# Altium schematic sheet Sensors_aux.SchDoc
size A3
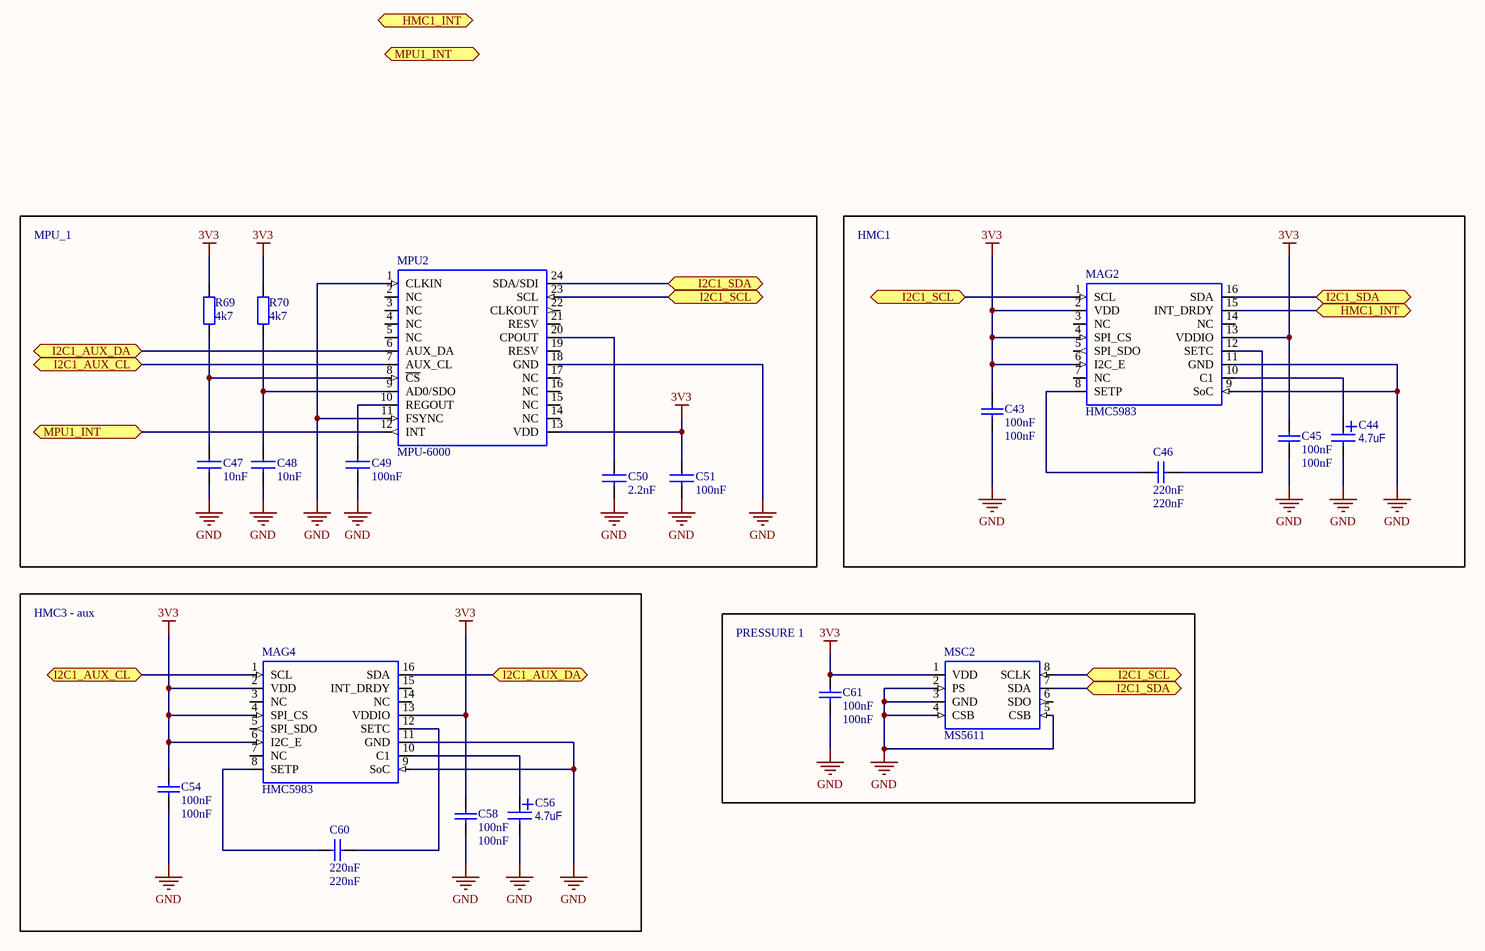
[diagram p0: Sensors_aux.SchDoc]

## Parts
C43  100nF  [080503]
C44  4.7uF  [120605]
C45  100nF  [080503]
C46  220nF  [080503]
C47  10nF  [080503]
C48  10nF  [080503]
C49  100nF  [080503]
C50  2.2nF  [080503]
C51  100nF  [080503]
C54  100nF  [080503]
C56  4.7uF  [120605]
C58  100nF  [080503]
C60  220nF  [080503]
C61  100nF  [080503]
MAG2  HMC5983  [QFN16]
MAG4  HMC5983  [QFN16]
MPU2  MPU-6000  [QFN24]
MSC2  MS5611  [MS5611]
R69  4k7  [080503]
R70  4k7  [080503]

## Blocks framed on the sheet
MPU_1: C47-C51 MPU2 R69 R70
HMC3 - aux: C54 C56 C58 C60 MAG4
PRESSURE 1: C61 MSC2

## Ports
HMC1_INT, I2C1_AUX_CL, I2C1_AUX_DA, I2C1_SCL, I2C1_SDA, MPU1_INT

## Nets
3V3: C43.1 C45.1 C51.1 C54.1 C58.1 C61.2 MAG2.2(VDD) MAG2.4(SPI_CS) MAG2.6(I2C_E) MAG2.13(VDDIO) MAG4.2(VDD) MAG4.4(SPI_CS) MAG4.6(I2C_E) MAG4.13(VDDIO) MPU2.13(VDD) MSC2.1(VDD) R69.2 R70.2
GND: C43.2 C44.2 C45.2 C47.2 C48.2 C49.2 C50.2 C51.2 C54.2 C56.2 C58.2 C61.1 MAG2.9(SoC) MAG2.11(GND) MAG4.9(SoC) MAG4.11(GND) MPU2.1(CLKIN) MPU2.11(FSYNC) MPU2.18(GND) MSC2.2(PS) MSC2.3(GND) MSC2.4(CSB) MSC2.5(CSB)
HMC1_INT: MAG2.15(INT_DRDY) ; port HMC1_INT
I2C1_AUX_CL: MAG4.1(SCL) MPU2.7(AUX_CL) ; port I2C1_AUX_CL
I2C1_AUX_DA: MAG4.16(SDA) MPU2.6(AUX_DA) ; port I2C1_AUX_DA
I2C1_SCL: MAG2.1(SCL) MPU2.23(SCL) MSC2.8(SCLK) ; port I2C1_SCL
I2C1_SDA: MAG2.16(SDA) MPU2.24(SDA/SDI) MSC2.7(SDA) ; port I2C1_SDA
MPU1_INT: MPU2.12(INT) ; port MPU1_INT
NetC44_1: C44.1 MAG2.10(C1)
NetC46_1: C46.1 MAG2.12(SETC)
NetC46_2: C46.2 MAG2.8(SETP)
NetC47_1: C47.1 MPU2.8(~{CS}) R69.1
NetC48_1: C48.1 MPU2.9(AD0/SDO) R70.1
NetC49_1: C49.1 MPU2.10(REGOUT)
NetC50_1: C50.1 MPU2.20(CPOUT)
NetC56_1: C56.1 MAG4.10(C1)
NetC60_1: C60.1 MAG4.12(SETC)
NetC60_2: C60.2 MAG4.8(SETP)

Not connected (* = marked no-connect by the designer): MAG2 3(NC) 5(SPI_SDO) 7(NC) 14(NC); MAG4 3(NC) 5(SPI_SDO) 7(NC) 14(NC) 15(INT_DRDY); MPU2 2(NC) 3(NC) 4(NC) 5(NC) 14(NC) 15(NC) 16(NC) 17(NC) 19(RESV) 21(RESV) 22(CLKOUT); MSC2 6(SDO)

## Notes on the sheet
- HMC1

## Library data of the parts
C43 C45 C54 C58 C61 = CAP: CAP CER 0.1UF 25V 10% X7R 0805; Value: 100nF; Supplier 1: Digi-Key; Supplier Part Number 1: 1276-1099-1-ND
C44 C56 = CAPA_T: CAP TANT 4.7uF 10V 10% 1206; Value: 4.7uF; Supplier 1: Digi-Key; Supplier Part Number 1: 399-3696-1-ND
C46 C60 = CAP: CAP CER 0.22uF 50V X7R 10% 0805; Value: 220nF; Supplier 1: Digi-Key; Supplier Part Number 1: 399-3491-1-ND
C47 C48 = CAPA: CAP CER 10nF 50V 10% X7R 0805; Value: 10nF; Supplier 1: Digi-Key; Supplier Part Number 1: 399-1158-1-ND
C49 C51 = CAPA: CAP CER 0.1UF 25V 10% X7R 0805; Value: 100nF; Supplier 1: Digi-Key; Supplier Part Number 1: 1276-1099-1-ND
C50 = CAPA: CAP CER 2.2nF 50V; Value: 2.2nF; Supplier 1: Digi-Key; Supplier Part Number 1: 399-11167-2-ND
MAG2 MAG4 = HMC5983: HMC5983 MAGNETOMETER; Supplier 1: Digi-Key; Supplier Part Number 1: 342-1092-1-ND
MPU2 = MPU-6000: MPU-6000 MOTION PROCESSOR; Supplier 1: Digi-Key; Supplier Part Number 1: 1428-1005-1-ND
MSC2 = MS5611: MS5611 PRESSURE SENSOR; Supplier 1: Mouser; Supplier Part Number 1: 824-MS561101BA03-50
R69 R70 = RES: RES 4.7K 0805; Value: 4k7; Supplier 1: Digi-Key; Supplier Part Number 1: RMCF0805FT4K70CT-ND